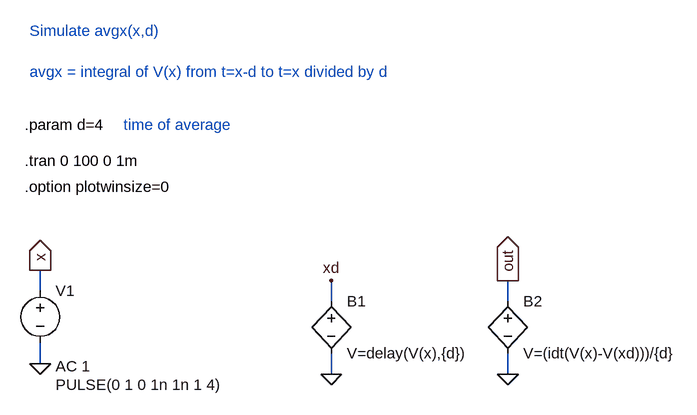
[diagram p0: schematic avgx1.asc]
avgx1.asc, the LTspice schematic file:
Version 4
SHEET 1 892 680
WIRE -384 -64 -384 -96
WIRE -384 48 -384 16
WIRE 64 -48 64 -80
WIRE 64 64 64 32
WIRE 336 -48 336 -80
WIRE 336 64 336 32
FLAG -384 48 0
FLAG -384 -96 x
IOPIN -384 -96 Out
FLAG 336 -80 out
IOPIN 336 -80 Out
FLAG 336 64 0
FLAG 64 -80 xd
FLAG 64 64 0
SYMBOL voltage -384 -80 R0
WINDOW 3 24 160 Left 0
WINDOW 123 24 132 Left 0
WINDOW 39 0 0 Left 0
SYMATTR Value PULSE(0 1 0 1n 1n 1 4)
SYMATTR Value2 AC 1
SYMATTR InstName V1
SYMBOL bv 336 -64 R0
SYMATTR InstName B2
SYMATTR Value V=(idt(V(x)-V(xd)))/{d}
SYMBOL bv 64 -64 R0
SYMATTR InstName B1
SYMATTR Value V=delay(V(x),{d})
TEXT -408 -264 Left 0 !.tran 0 100 0 1m
TEXT -408 -224 Left 0 !.option plotwinsize=0
TEXT -400 -464 Left 0 ;Simulate avgx(x,d)\n \navgx = integral of V(x) from t=x-d to t=x divided by d
TEXT -408 -320 Left 0 !.param d=4
TEXT -256 -320 Left 0 ;time of average

The netlist it stands for:
* avgx1.asc
V1 x 0 PULSE(0 1 0 1n 1n 1 4) AC 1
B2 out 0 V=(idt(V(x)-V(xd)))/{d}
B1 xd 0 V=delay(V(x),{d})
.tran 0 100 0 1m
.option plotwinsize=0
* Simulate avgx(x,d)
* avgx = integral of V(x) from t=x-d to t=x divided by d
.param d=4
* time of average
.backanno
.end